# Altium schematic sheet power.SCHDOC
size B
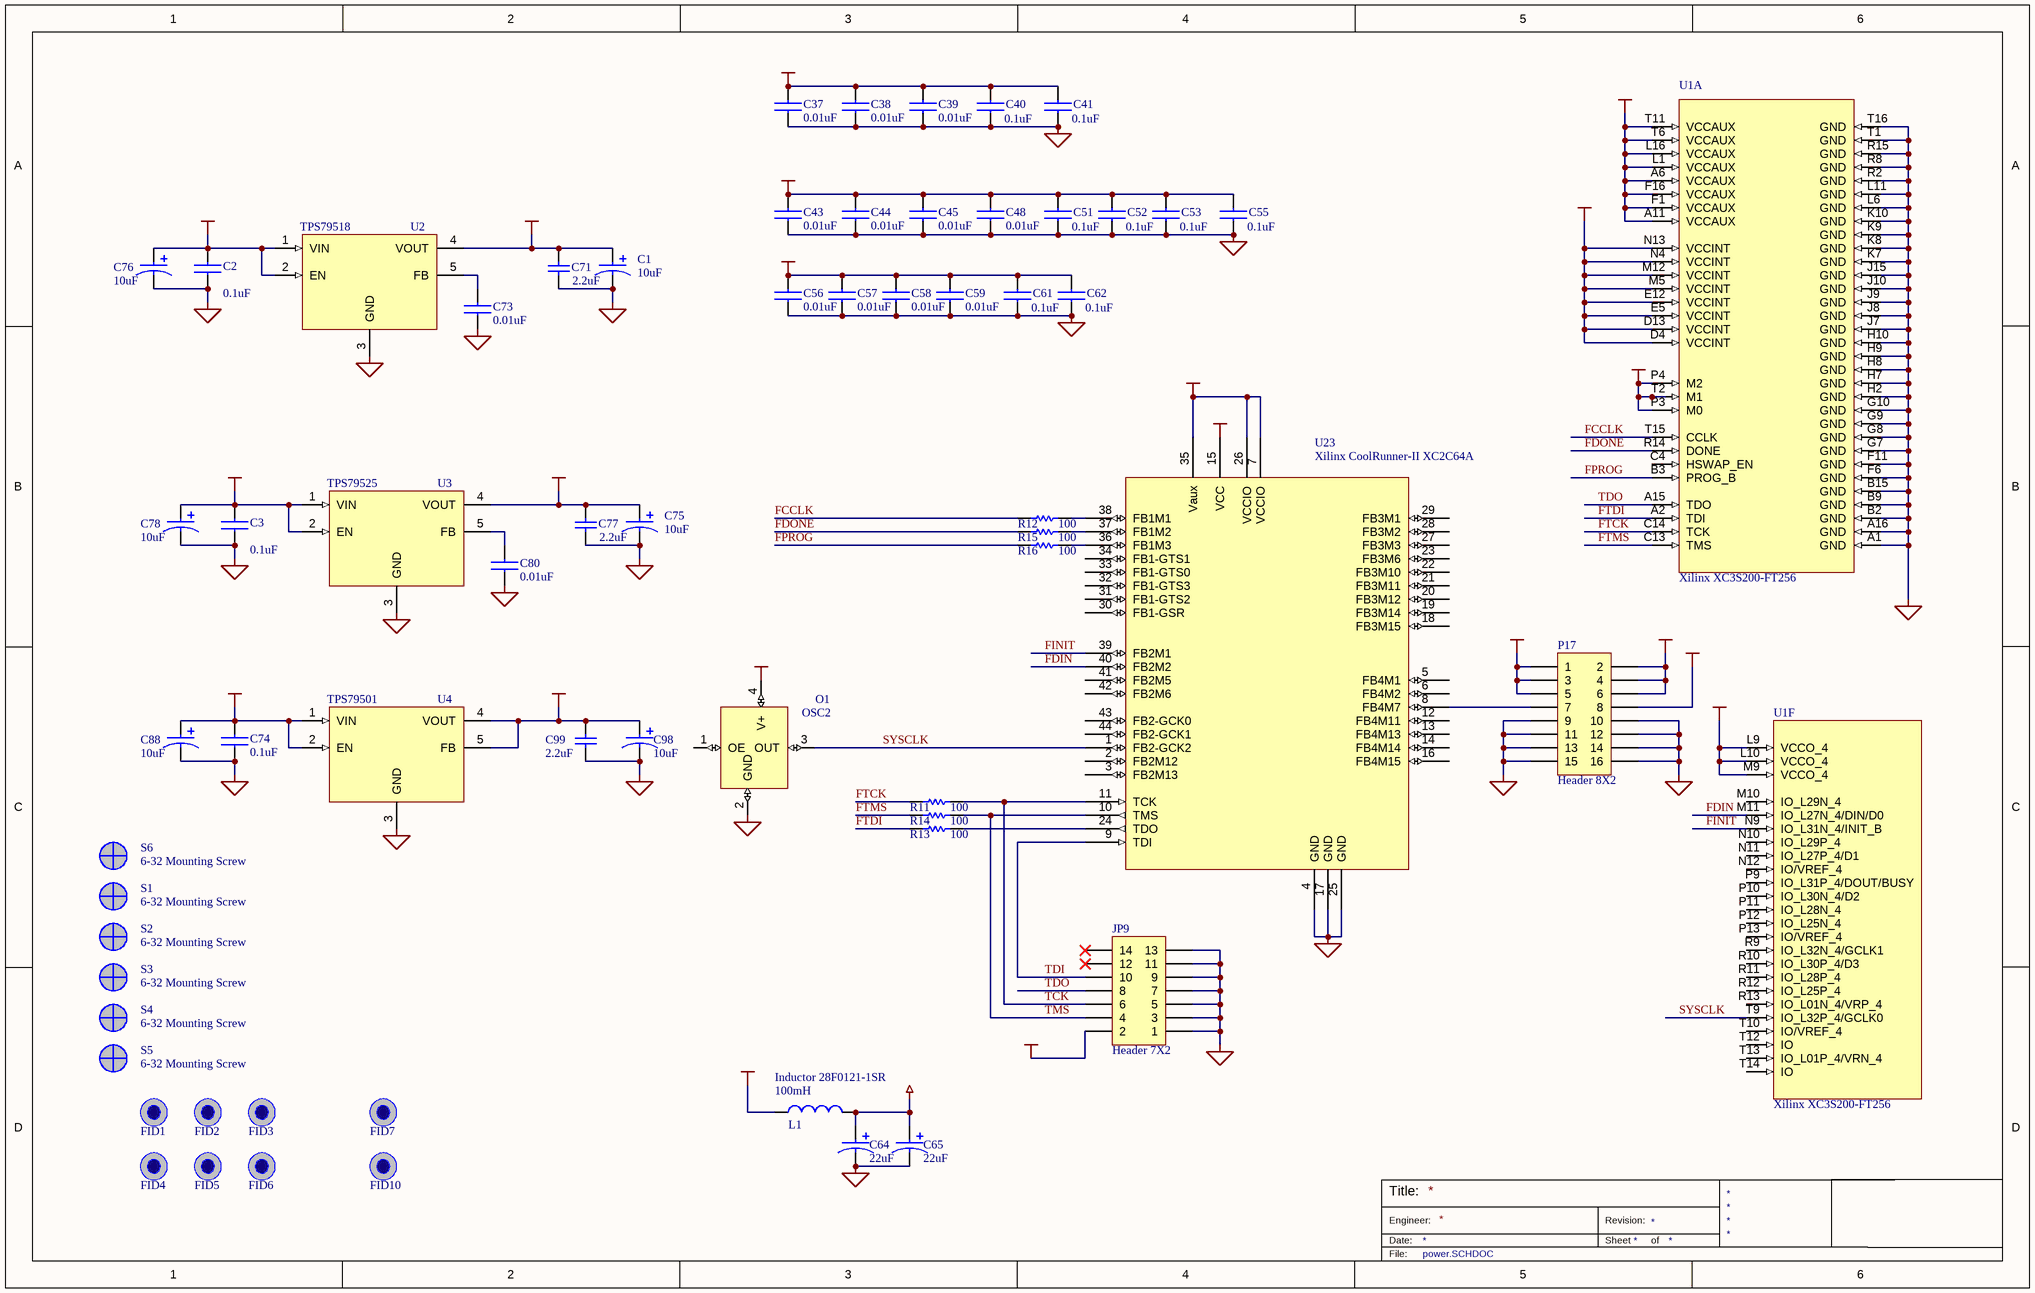
[diagram p0: power.SCHDOC]

## Parts
C1  value 10uF  [6032]  (hidden comment: POLCAP2)
C2  value 0.1uF  [0603]  (hidden comment: CAPACITOR)
C3  value 0.1uF  [0603]  (hidden comment: CAPACITOR)
C37  value 0.01uF  [0402]  (hidden comment: CAPACITOR)
C38  value 0.01uF  [0402]  (hidden comment: CAPACITOR)
C39  value 0.01uF  [0402]  (hidden comment: CAPACITOR)
C40  value 0.1uF  [0603]  (hidden comment: CAPACITOR)
C41  value 0.1uF  [0603]  (hidden comment: CAPACITOR)
C43  value 0.01uF  [0402]  (hidden comment: CAPACITOR)
C44  value 0.01uF  [0402]  (hidden comment: CAPACITOR)
C45  value 0.01uF  [0402]  (hidden comment: CAPACITOR)
C48  value 0.01uF  [0402]  (hidden comment: CAPACITOR)
C51  value 0.1uF  [0603]  (hidden comment: CAPACITOR)
C52  value 0.1uF  [0603]  (hidden comment: CAPACITOR)
C53  value 0.1uF  [0603]  (hidden comment: CAPACITOR)
C55  value 0.1uF  [0603]  (hidden comment: CAPACITOR)
C56  value 0.01uF  [0402]  (hidden comment: CAPACITOR)
C57  value 0.01uF  [0402]  (hidden comment: CAPACITOR)
C58  value 0.01uF  [0402]  (hidden comment: CAPACITOR)
C59  value 0.01uF  [0402]  (hidden comment: CAPACITOR)
C61  value 0.1uF  [0603]  (hidden comment: CAPACITOR)
C62  value 0.1uF  [0603]  (hidden comment: CAPACITOR)
C64  value 22uF  [6032]  (hidden comment: POLCAP2)
C65  value 22uF  [6032]  (hidden comment: POLCAP2)
C71  value 2.2uF  [1206]  (hidden comment: Cap)
C73  value 0.01uF  [0402]  (hidden comment: CAPACITOR)
C74  value 0.1uF  [0603]  (hidden comment: CAPACITOR)
C75  value 10uF  [6032]  (hidden comment: POLCAP2)
C76  value 10uF  [6032]  (hidden comment: POLCAP2)
C77  value 2.2uF  [1206]  (hidden comment: Cap)
C78  value 10uF  [6032]  (hidden comment: POLCAP2)
C80  value 0.01uF  [0402]  (hidden comment: CAPACITOR)
C88  value 10uF  [6032]  (hidden comment: POLCAP2)
C98  value 10uF  [6032]  (hidden comment: POLCAP2)
C99  value 2.2uF  [1206]  (hidden comment: Cap)
FID1  FIDUCIAL  [FIDUCIAL]  (value not drawn)
FID2  FIDUCIAL  [FIDUCIAL]  (value not drawn)
FID3  FIDUCIAL  [FIDUCIAL]  (value not drawn)
FID4  FIDUCIAL  [FIDUCIAL]  (value not drawn)
FID5  FIDUCIAL  [FIDUCIAL]  (value not drawn)
FID6  FIDUCIAL  [FIDUCIAL]  (value not drawn)
FID7  FIDUCIAL  [FIDUCIAL]  (value not drawn)
FID10  FIDUCIAL  [FIDUCIAL]  (value not drawn)
JP9  Header 7X2  [SMT 2x7 2mm HDR]
L1  Inductor 28F0121-1SR  value 100mH  [STEWARD_1SR]
O1  OSC2  [ECS-3953M]
P17  Header 8X2  [MOLEX 15-91-2160]
R11  value 100  [0603]  (hidden comment: current-limiting series res)
R12  value 100  [0603]  (hidden comment: current-limiting series res)
R13  value 100  [0603]  (hidden comment: current-limiting series res)
R14  value 100  [0603]  (hidden comment: current-limiting series res)
R15  value 100  [0603]  (hidden comment: current-limiting series res)
R16  value 100  [0603]  (hidden comment: current-limiting series res)
S1  6-32 Mounting Screw  [SCREW6-32]
S2  6-32 Mounting Screw  [SCREW6-32]
S3  6-32 Mounting Screw  [SCREW6-32]
S4  6-32 Mounting Screw  [SCREW6-32]
S5  6-32 Mounting Screw  [SCREW6-32]
S6  6-32 Mounting Screw  [SCREW6-32]
U1  Xilinx XC3S200-FT256  [Xilinx FT256 BGA]  (parts A,F of 9)
U2  TPS79518  [SOT223-5/Simple]
U3  TPS79525  [SOT223-5/Simple]
U4  TPS79501  [SOT223-5/Simple]
U23  Xilinx CoolRunner-II XC2C64A  [QFP10x10-G44/G10N]

## Nets
+1.2VCC: C37.1 C38.1 C39.1 C40.1 C41.1 C98.1 C99.2 U1.D4(VCCINT) U1.D13(VCCINT) U1.E5(VCCINT) U1.E12(VCCINT) U1.M5(VCCINT) U1.M12(VCCINT) U1.N4(VCCINT) U1.N13(VCCINT) U4.4(VOUT) U4.5(FB)
+1.8VCC: C1.1 C71.2 U2.4(VOUT) U23.15(VCC)
+2.5VCC: C43.1 C44.1 C45.1 C48.1 C51.1 C52.1 C53.1 C55.1 C75.1 C77.2 U1.A6(VCCAUX) U1.A11(VCCAUX) U1.F1(VCCAUX) U1.F16(VCCAUX) U1.L1(VCCAUX) U1.L16(VCCAUX) U1.T6(VCCAUX) U1.T11(VCCAUX) U3.4(VOUT)
+5VCC: L1.1 P17.2 P17.4 P17.6
+12VCC: P17.8
AVDD: C64.1 C65.1 L1.2
GND: C1.2 C2.1 C3.1 C37.2 C38.2 C39.2 C40.2 C41.2 C43.2 C44.2 C45.2 C48.2 C51.2 C52.2 C53.2 C55.2 C56.2 C57.2 C58.2 C59.2 C61.2 C62.2 C64.2 C65.2 C71.1 C73.1 C74.1 C75.2 C76.2 C77.1 C78.2 C80.1 C88.2 C98.2 C99.1 JP9.1 JP9.3 JP9.5 JP9.7 JP9.9 JP9.11 JP9.13 O1.2(GND) P17.9 P17.10 P17.11 P17.12 P17.13 P17.14 P17.15 P17.16 U1.A1(GND) U1.A16(GND) U1.B2(GND) U1.B9(GND) U1.B15(GND) U1.F6(GND) U1.F11(GND) U1.G7(GND) U1.G8(GND) U1.G9(GND) U1.G10(GND) U1.H2(GND) U1.H7(GND) U1.H8(GND) U1.H9(GND) U1.H10(GND) U1.J7(GND) U1.J8(GND) U1.J9(GND) U1.J10(GND) U1.J15(GND) U1.K7(GND) U1.K8(GND) U1.K9(GND) U1.K10(GND) U1.L6(GND) U1.L11(GND) U1.R2(GND) U1.R8(GND) U1.R15(GND) U1.T1(GND) U1.T16(GND) U2.3(GND) U3.3(GND) U4.3(GND) U23.4(GND) U23.17(GND) U23.25(GND)
VCC: C2.2 C3.2 C56.1 C57.1 C58.1 C59.1 C61.1 C62.1 C74.2 C76.1 C78.1 C88.1 JP9.2 O1.4(V+) P17.1 P17.3 P17.5 U1.L9(VCCO_4) U1.L10(VCCO_4) U1.M9(VCCO_4) U1.P3(M0) U1.P4(M2) U1.T2(M1) U2.1(VIN) U2.2(EN) U3.1(VIN) U3.2(EN) U4.1(VIN) U4.2(EN) U23.7(VCCIO) U23.26(VCCIO) U23.35(Vaux)
FCCLK: R12.2 U1.T15(CCLK)
FDIN: U1.M11(IO_L27N_4/DIN/D0) U23.40(FB2M2)
FDONE: R15.2 U1.R14(DONE)
FINIT: U1.N9(IO_L31N_4/INIT_B) U23.39(FB2M1)
FPROG: R16.2 U1.B3(PROG_B)
FTCK: R11.2 U1.C14(TCK)
FTDI: R13.2 U1.A2(TDI)
FTMS: R14.1 U1.C13(TMS)
SYSCLK: O1.3(OUT) U1.T9(IO_L32P_4/GCLK0) U23.1(FB2-GCK2)
TCK: JP9.6 R11.1 U23.11(TCK)
TDI: JP9.10 U23.9(TDI)
TDO: JP9.8 U1.A15(TDO)
TMS: JP9.4 R14.2 U23.10(TMS)
NetC73_2: C73.2 U2.5(FB)
NetC80_2: C80.2 U3.5(FB)
NetP17_7: P17.7 U23.8(FB4M7)
NetR12_1: R12.1 U23.38(FB1M1)
NetR13_1: R13.1 U23.24(TDO)
NetR15_1: R15.1 U23.37(FB1M2)
NetR16_1: R16.1 U23.36(FB1M3)

Not connected (* = marked no-connect by the designer): JP9 12* 14*; O1 1(OE); U1 C4(HSWAP_EN) M10(IO_L29N_4) N10(IO_L29P_4) N11(IO_L27P_4/D1) N12(IO/VREF_4) P9(IO_L31P_4/DOUT/BUSY) P10(IO_L30N_4/D2) P11(IO_L28N_4) P12(IO_L25N_4) P13(IO/VREF_4) R9(IO_L32N_4/GCLK1) R10(IO_L30P_4/D3) R11(IO_L28P_4) R12(IO_L25P_4) R13(IO_L01N_4/VRP_4) T10(IO/VREF_4) T12(IO) T13(IO_L01P_4/VRN_4) T14(IO); U23 2(FB2M12) 3(FB2M13) 5(FB4M1) 6(FB4M2) 12(FB4M11) 13(FB4M13) 14(FB4M14) 16(FB4M15) 18(FB3M15) 19(FB3M14) 20(FB3M12) 21(FB3M11) 22(FB3M10) 23(FB3M6) 27(FB3M3) 28(FB3M2) 29(FB3M1) 30(FB1-GSR) 31(FB1-GTS2) 32(FB1-GTS3) 33(FB1-GTS0) 34(FB1-GTS1) 41(FB2M5) 42(FB2M6) 43(FB2-GCK0) 44(FB2-GCK1)

## Notes on the sheet
- Title:
- Engineer:
- Date:
- Revision:
- Sheet
- of
- File:

## Library data of the parts
C1 C64 C65 C75 C76 C78 C88 C98 = POLCAP2: Standard Capacitor
C2 C3 C73 C74 C80 = CAPACITOR: Standard Capacitor
C37-C41 C43-C45 C48 C51-C53 C55-C59 C61 C62 = CAPACITOR: Standard Capacitor; Type: X7R
C71 C77 C99 = Cap: Capacitor; Manufacturer: Generic Components; Class I: Passive; Published: 8-Jun-2000; Revision: July-2002: Re-released for DXP Platform.; Publisher: Altium Limited; Class II: Capacitor
JP9 = Header 7X2: Header, 7-Pin, Dual row; Manufacturer: Generic Components; Class I: Connector; Revision: July-2002: Re-released for DXP Platform.; Publisher: Altium Limited
L1 = Inductor: Manufacturer: Generic Components; Class I: Passive; Published: 8-Jun-2000; Revision: July-2002: Re-released for DXP Platform.; Publisher: Altium Limited; Class II: Inductor
O1 = OSC2: ECS SMD Oscillator, ECS-3953M
P17 = Header 8X2: Header, 8-Pin, Dual row; LatestRevisionDate: 17-Jul-2002; LatestRevisionNote: Re-released for DXP Platform.; Publisher: Altium Limited
R11-R16 = RESISTOR: Standard Passive Resistor; Tolerance: 1%
S1-S6 = MNTSCREW
U1 = XC3S200-FT256: Xilinx Spartan-3 FPGA
U2-U4 = TPS795XX: TI Ultra-low-noise LDO
U23 = XC2C64A-5VQ44C